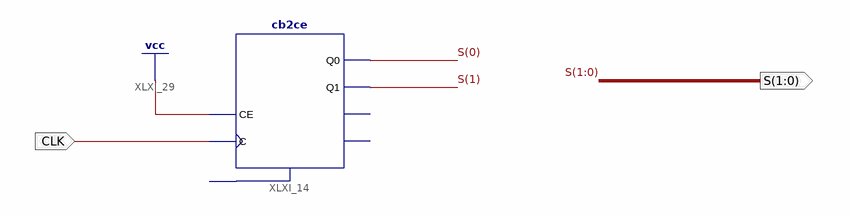
[diagram p0: schematic sheet 1]
// Xilinx ISE schematic SELECTOR.sch (spartan6) as structural Verilog: 1 symbols, 2 ports
module SELECTOR (
  input  CLK,
  output [1:0] S
);

  cb2ce XLXI_14 (.C(CLK), .CE(1'b1), .Q0(S[0]), .Q1(S[1]));  // open: CLR, CEO, TC
endmodule
